# Altium schematic sheet 6_communication_buffers.schdoc: Communication Buffers
size A4; Engineer: Eng_2_ALT; SheetNumber: 6; SheetTotal: 6; Designed by: André M. P. Mattos; Version: v0.5
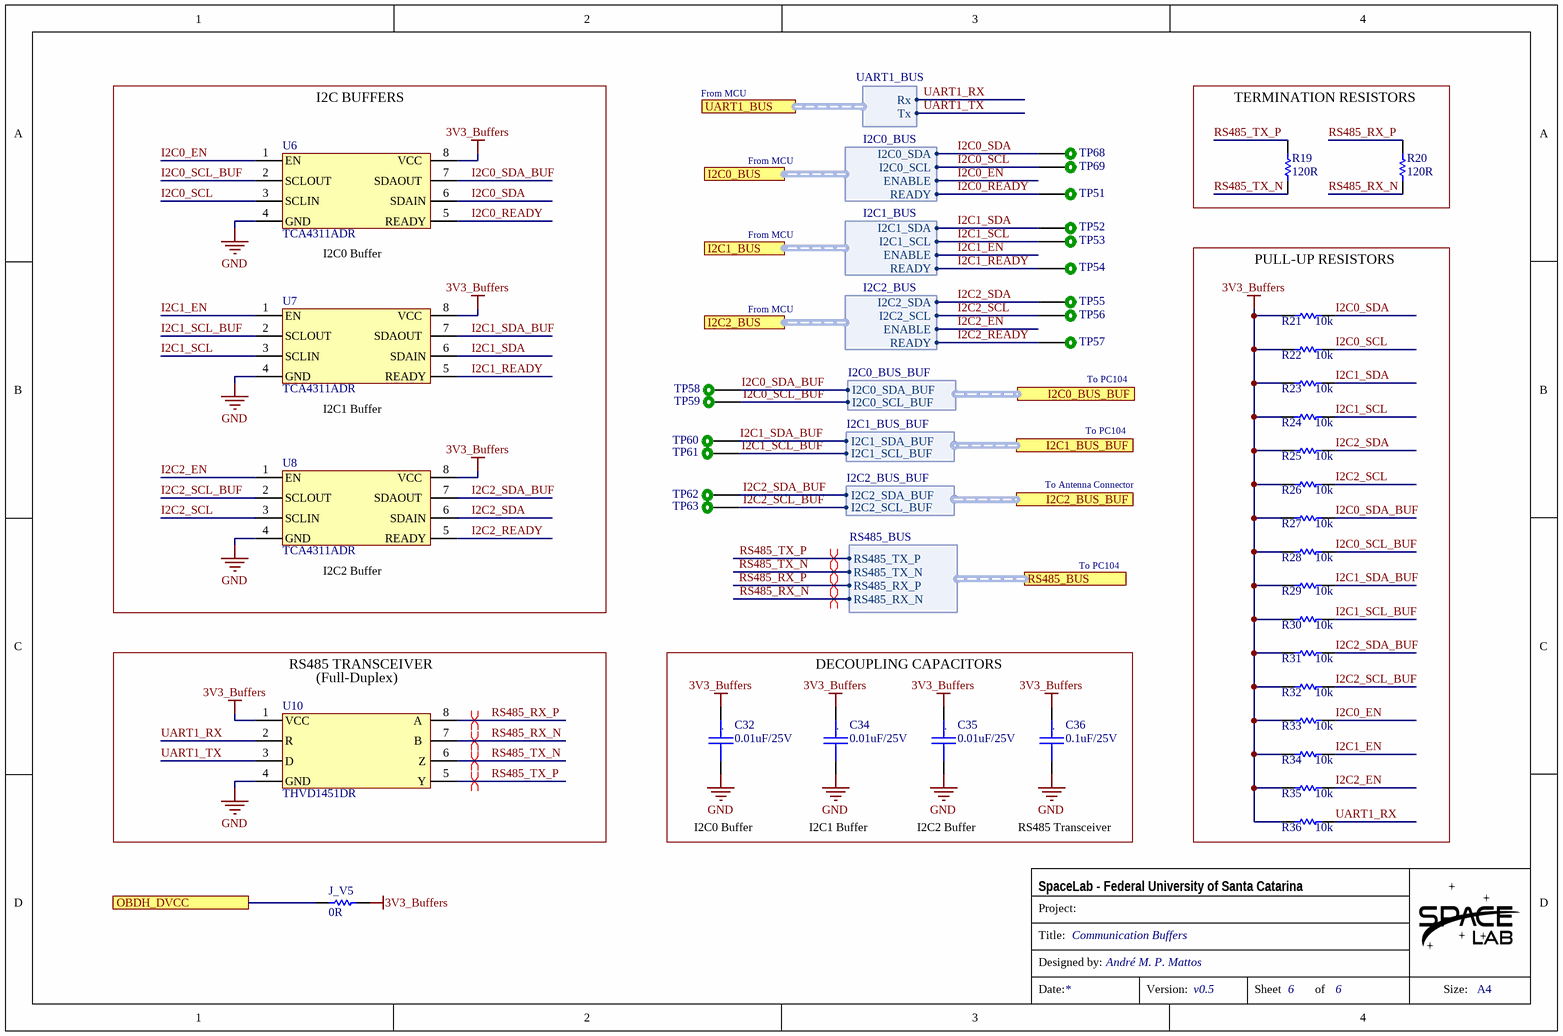
[diagram p0: 6_communication_buffers.schdoc]

## Parts
C32  0.01uF/25V  [CC0805]
C34  0.01uF/25V  [CC0805]
C35  0.01uF/25V  [CC0805]
C36  0.1uF/25V  [CC0805]
J_V5  0R  [0805]
R19  120R  [0805]
R20  120R  [0805]
R21  10k  [0805]
R22  10k  [0805]
R23  10k  [0805]
R24  10k  [0805]
R25  10k  [0805]
R26  10k  [0805]
R27  10k  [0805]
R28  10k  [0805]
R29  10k  [0805]
R30  10k  [0805]
R31  10k  [0805]
R32  10k  [0805]
R33  10k  [0805]
R34  10k  [0805]
R35  10k  [0805]
R36  10k  [0805]
TP51  TEST_POINT_2  [TEST_POINT_2]  (value not drawn)  (no BOM)
TP52  TEST_POINT_2  [TEST_POINT_2]  (value not drawn)  (no BOM)
TP53  TEST_POINT_2  [TEST_POINT_2]  (value not drawn)  (no BOM)
TP54  TEST_POINT_2  [TEST_POINT_2]  (value not drawn)  (no BOM)
TP55  TEST_POINT_2  [TEST_POINT_2]  (value not drawn)  (no BOM)
TP56  TEST_POINT_2  [TEST_POINT_2]  (value not drawn)  (no BOM)
TP57  TEST_POINT_2  [TEST_POINT_2]  (value not drawn)  (no BOM)
TP58  TEST_POINT_2  [TEST_POINT_2]  (value not drawn)  (no BOM)
TP59  TEST_POINT_2  [TEST_POINT_2]  (value not drawn)  (no BOM)
TP60  TEST_POINT_2  [TEST_POINT_2]  (value not drawn)  (no BOM)
TP61  TEST_POINT_2  [TEST_POINT_2]  (value not drawn)  (no BOM)
TP62  TEST_POINT_2  [TEST_POINT_2]  (value not drawn)  (no BOM)
TP63  TEST_POINT_2  [TEST_POINT_2]  (value not drawn)  (no BOM)
TP68  TEST_POINT_2  [TEST_POINT_2]  (value not drawn)  (no BOM)
TP69  TEST_POINT_2  [TEST_POINT_2]  (value not drawn)  (no BOM)
U6  TCA4311ADR  [SOIC8]
U7  TCA4311ADR  [SOIC8]
U8  TCA4311ADR  [SOIC8]
U10  THVD1451DR  [SOIC8]

## Blocks framed on the sheet
I2C BUFFERS: U6-U8
TERMINATION RESISTORS: R19 R20
PULL-UP RESISTORS: R21-R36
DECOUPLING CAPACITORS: C32 C34-C36

## Ports
I2C0_BUS (harness I2C0_BUS), I2C0_BUS_BUF (harness I2C0_BUS_BUF), I2C1_BUS (harness I2C1_BUS), I2C1_BUS_BUF (harness I2C1_BUS_BUF), I2C2_BUS (harness I2C2_BUS), I2C2_BUS_BUF (harness I2C2_BUS_BUF), OBDH_DVCC, RS485_BUS (harness RS485_BUS), UART1_BUS (harness UART1_BUS)

## Harnesses
I2C0_BUS_BUF: I2C0_SDA_BUF, I2C0_SCL_BUF
I2C2_BUS_BUF: I2C2_SDA_BUF, I2C2_SCL_BUF
I2C1_BUS_BUF: I2C1_SDA_BUF, I2C1_SCL_BUF
RS485_BUS: RS485_TX_P, RS485_TX_N, RS485_RX_P, RS485_RX_N
I2C0_BUS: I2C0_SCL, I2C0_SDA, ENABLE, READY
UART1_BUS: Rx, Tx
I2C1_BUS: I2C1_SCL, I2C1_SDA, ENABLE, READY
I2C2_BUS: I2C2_SCL, I2C2_SDA, ENABLE, READY

## Nets
3V3_Buffers: C32.1 C34.1 C35.1 C36.1 J_V5.1 R21.2 R22.2 R23.2 R24.2 R25.2 R26.2 R27.2 R28.2 R29.2 R30.2 R31.2 R32.2 R33.2 R34.2 R35.2 R36.2 U6.8(VCC) U7.8(VCC) U8.8(VCC) U10.1(VCC)
GND: C32.2 C34.2 C35.2 C36.2 U6.4(GND) U7.4(GND) U8.4(GND) U10.4(GND)
I2C0_EN: R33.1 U6.1(EN) ; port I2C0_BUS.ENABLE
I2C0_READY: TP51.1 U6.5(READY) ; port I2C0_BUS.READY
I2C0_SCL: R22.1 TP69.1 U6.3(SCLIN) ; port I2C0_BUS.I2C0_SCL
I2C0_SCL_BUF: R28.1 TP59.1 U6.2(SCLOUT) ; port I2C0_BUS_BUF.I2C0_SCL_BUF
I2C0_SDA: R21.1 TP68.1 U6.6(SDAIN) ; port I2C0_BUS.I2C0_SDA
I2C0_SDA_BUF: R27.1 TP58.1 U6.7(SDAOUT) ; port I2C0_BUS_BUF.I2C0_SDA_BUF
I2C1_EN: R34.1 U7.1(EN) ; port I2C1_BUS.ENABLE
I2C1_READY: TP54.1 U7.5(READY) ; port I2C1_BUS.READY
I2C1_SCL: R24.1 TP53.1 U7.3(SCLIN) ; port I2C1_BUS.I2C1_SCL
I2C1_SCL_BUF: R30.1 TP61.1 U7.2(SCLOUT) ; port I2C1_BUS_BUF.I2C1_SCL_BUF
I2C1_SDA: R23.1 TP52.1 U7.6(SDAIN) ; port I2C1_BUS.I2C1_SDA
I2C1_SDA_BUF: R29.1 TP60.1 U7.7(SDAOUT) ; port I2C1_BUS_BUF.I2C1_SDA_BUF
I2C2_EN: R35.1 U8.1(EN) ; port I2C2_BUS.ENABLE
I2C2_READY: TP57.1 U8.5(READY) ; port I2C2_BUS.READY
I2C2_SCL: R26.1 TP56.1 U8.3(SCLIN) ; port I2C2_BUS.I2C2_SCL
I2C2_SCL_BUF: R32.1 TP63.1 U8.2(SCLOUT) ; port I2C2_BUS_BUF.I2C2_SCL_BUF
I2C2_SDA: R25.1 TP55.1 U8.6(SDAIN) ; port I2C2_BUS.I2C2_SDA
I2C2_SDA_BUF: R31.1 TP62.1 U8.7(SDAOUT) ; port I2C2_BUS_BUF.I2C2_SDA_BUF
OBDH_DVCC: J_V5.2 ; port OBDH_DVCC
RS485_RX_N: R20.2 U10.7(B) ; port RS485_BUS.RS485_RX_N
RS485_RX_P: R20.1 U10.8(A) ; port RS485_BUS.RS485_RX_P
RS485_TX_N: R19.2 U10.6(Z) ; port RS485_BUS.RS485_TX_N
RS485_TX_P: R19.1 U10.5(Y) ; port RS485_BUS.RS485_TX_P
UART1_RX: R36.1 U10.2(R) ; port UART1_BUS.Rx
UART1_TX: U10.3(D) ; port UART1_BUS.Tx

## Layout directives
differential pair: RS485_RX_N, RS485_RX_P, RS485_TX_N, RS485_TX_P

## Notes on the sheet
- From MCU
- (near U6) I2C0 Buffer
- (near TP57) To PC104
- (near U7) I2C1 Buffer
- To PC104
- To Antenna Connector
- (near U8) I2C2 Buffer
- (near U10) RS485 TRANSCEIVER
- (near U10) (Full-Duplex)
- I2C0 Buffer
- I2C1 Buffer
- I2C2 Buffer
- RS485 Transceiver
- Project:
- SpaceLab - Federal University of Santa Catarina
- Title:
- Designed by:
- Date:
- Version:
- Sheet
- of
- Size:
- A4
- (in symbol Cap_Cer_X7R_0.1uF_25V_0805) .
- (in symbol Cap_Cer_X7R_0.01uF_50V_0805) .

## Library data of the parts
C32 C34 C35 = Cap_Cer_X7R_0.01uF_50V_0805: CAP CER 0.01uF 25V 10% X7R 0805; Partnumber: CL21B103KAANNNC; NCM: 8532.24.10
C36 = Cap_Cer_X7R_0.1uF_25V_0805: CAP CER 0.1UF 25V 10% X7R 0805; Partnumber: CC0805KRX7R8BB104; NCM: 8532.24.10
J_V5 = R0R_JUMPER_1/16W_0805: RES 0R OHM 1/16W JUMPER 0805; Partnumber: CRCW08050000Z0EA; NCM: 8533.21.20
R19 R20 = R120R_1%_1/4W_0805: RES 120R OHM 1/8W 1% 0805; Partnumber: CRGCQ0805F120R; NCM: 8533.21.20
R21-R36 = R10k_1%_1/8W_0805: RES 10K OHM 1/8W 1%  0805; Partnumber: CRCW080510K0FKEA; NCM: 8533.21.20
TP51-TP63 TP68 TP69 = TEST_POINT_2: Test point
U6-U8 = TCA4311ADR: IC SIGNAL BUFFER I2C 8SOIC; Partnumber: TCA4311ADR
U10 = THVD1451DR: IC INTERFACE RS422_RS485 8SOIC; Partnumber: THVD1451DR